# EAGLE schematic schematic (EAGLE 9.2.2)
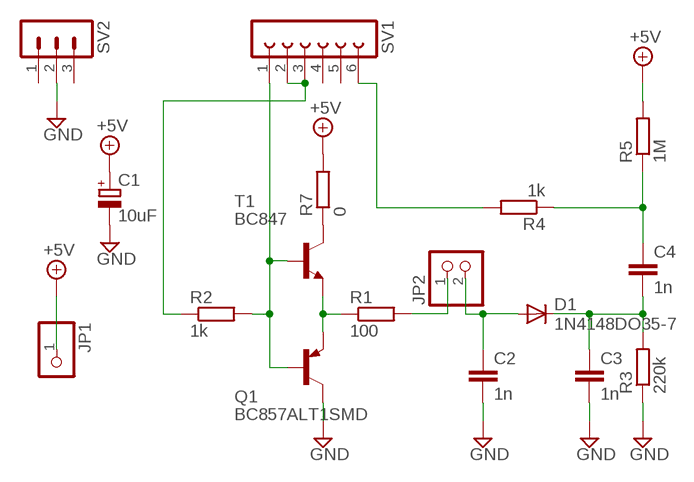
[diagram p0: schematic, sheet 1]

## Parts
C1  10uF  CPOL-EUE2.5-6  [E2,5-6]
C2  1n  C-EU050-024X044  [C050-024X044]
C3  1n  C-EU050-024X044  [C050-024X044]
C4  1n  C-EU050-024X044  [C050-024X044]
D1  1N4148DO35-7  [DO35-7]
JP1  PINHD-1X1  [1X01]
JP2  PINHD-1X2  [1X02]
Q1  BC857ALT1SMD  [SOT23-BEC]
R1  100  R-EU_0207/10  [0207/10]
R2  1k  R-EU_0207/10  [0207/10]
R3  220k  R-EU_0207/10  [0207/10]
R4  1k  R-EU_0207/10  [0207/10]
R5  1M  R-EU_0207/10  [0207/10]
R7  0  R-EU_0204/5  [0204/5]
SV1  FE06-1  [FE06]
SV2  MA03-1  [MA03-1]
T1  BC847  [SOT23]

## Nets
+5V: C1.+ JP1.1 R5.2 R7.2
GND: C1.- C2.2 C3.2 Q1.C R3.1 SV2.2
N$1: Q1.E R1.1 T1.2(E)
N$2: Q1.B R2.2 SV1.1 T1.1(B)
N$4: JP2.1 R1.2
N$5: C2.1 D1.A JP2.2
N$6: C3.1 C4.2 D1.C R3.2
N$7: C4.1 R4.1 R5.1
N$8: R4.2 SV1.6
N$9: R7.1 T1.3(C)
N$10: R2.1 SV1.2 SV1.3
Unconnected: SV1.4 SV1.5 SV2.1 SV2.3

## Library data of the parts
C1 = rcl:CPOL-EU: POLARIZED CAPACITOR, European symbol
C2-C4 = rcl:C-EU: CAPACITOR, European symbol
D1 = diode:1N4148: DIODE high speed (Philips)
JP1 = pinhead:PINHD-1X1: PIN HEADER
JP2 = pinhead:PINHD-1X2: PIN HEADER
Q1 = transistor-pnp:BC857*: PNP Transistror
R1-R5 R7 = rcl:R-EU_: RESISTOR, European symbol
SV1 = con-lsta:FE06-1: FEMALE HEADER
SV2 = con-lstb:MA03-1: PIN HEADER
T1 = transistor-neu-to92:BC847: NPN TRANSISTOR